# EAGLE design radio_V11.04.12 (EAGLE 5.01)
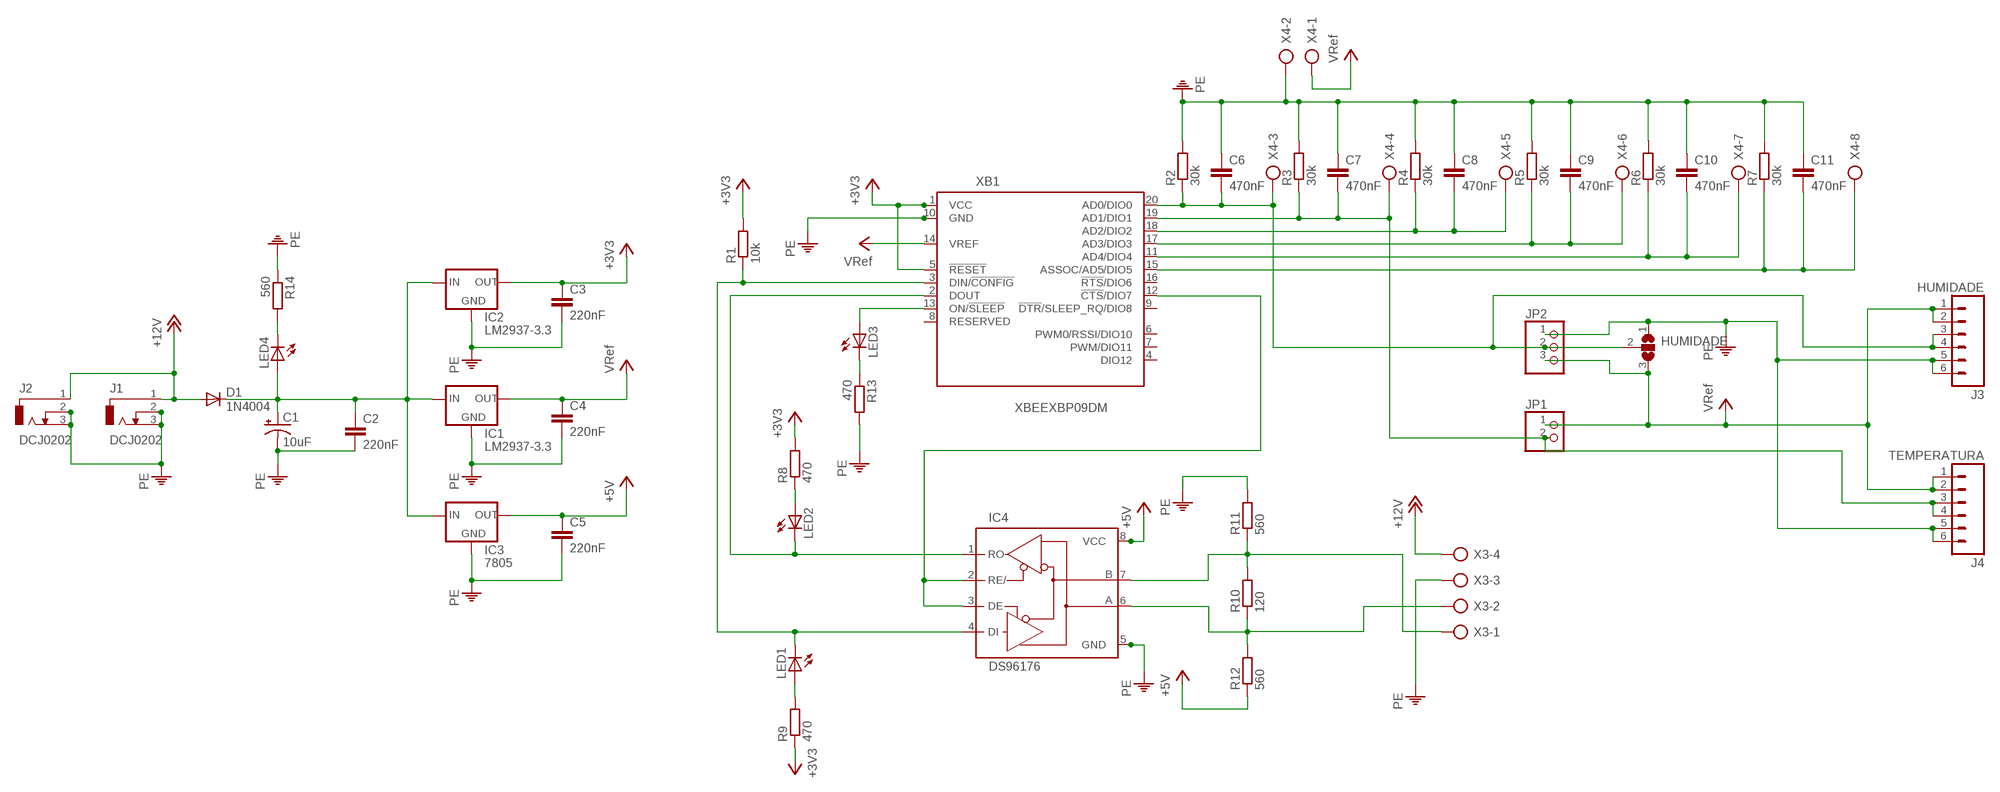
[diagram p0: schematic, sheet 1]

## Parts
C1  10uF  CPOL-USE2-5  [E2-5]
C2  220nF  C5/3.5  [C5B3.5]
C3  220nF  C5/3.5  [C5B3.5]
C4  220nF  C5/3.5  [C5B3.5]
C5  220nF  C5/3.5  [C5B3.5]
C6  470nF  C5/3.5  [C5B3.5]
C7  470nF  C5/3.5  [C5B3.5]
C8  470nF  C5/3.5  [C5B3.5]
C9  470nF  C5/3.5  [C5B3.5]
C10  470nF  C5/3.5  [C5B3.5]
C11  470nF  C5/3.5  [C5B3.5]
D1  1N4004  [DO41-10]
HUMIDADE  SJ2W  [SJ_2]
IC1  LM2937-3.3  78XXL  [78XXL]
IC2  LM2937-3.3  78XXL  [78XXL]
IC3  7805  78XXL  [78XXL]
IC4  DS96176  MAX3468CPA  [DIL08]
J1  DCJ0202  [DCJ0202]
J2  DCJ0202  [DCJ0202]
J3  HUMIDADE  RJ11-6PTH  [RJ11-6]
J4  TEMPERATURA  RJ11-6PTH  [RJ11-6]
JP1  PINHD-1X2  [1X02]
JP2  PINHD-1X3  [1X03]
LED1  LED3MM  [LED3MM]
LED2  LED3MM  [LED3MM]
LED3  LED3MM  [LED3MM]
LED4  LED5MM  [LED5MM]
R1  10k  R-EU_0207/7  [0207/7]
R2  30k  R-EU_0207/7  [0207/7]
R3  30k  R-EU_0207/7  [0207/7]
R4  30k  R-EU_0207/7  [0207/7]
R5  30k  R-EU_0207/7  [0207/7]
R6  30k  R-EU_0207/7  [0207/7]
R7  30k  R-EU_0207/7  [0207/7]
R8  470  R-EU_0207/7  [0207/7]
R9  470  R-EU_0207/7  [0207/7]
R10  120  R-EU_0207/7  [0207/7]
R11  560  R-EU_0207/7  [0207/7]
R12  560  R-EU_0207/7  [0207/7]
R13  470  R-EU_0207/7  [0207/7]
R14  560  R-EU_0207/7  [0207/7]
X3  AK500/4-H  [AK500/4-H]
X4  AK500/8-H  [AK500/8-H]
XB1  XBEEXBP09DM  [XBEE-PRO]

## Nets
+3V3: C3.1 IC2.OUT R1.2 R8.2 R9.1 XB1.1(VCC) XB1.5(!RESET)
+5V: C5.1 IC3.OUT IC4.8(VCC) R12.1
+12V: D1.A J1.1 J2.1 X3.4
CTS: IC4.2(RE/) IC4.3(DE) XB1.12(!CTS!/DIO7)
DIN: IC4.4(DI) LED1.K(C) R1.1 XB1.3(DIN/!CONFIG)
N$2: C1.+ C2.1 D1.C IC1.IN IC2.IN IC3.IN LED4.A
N$3: C6.2 HUMIDADE.2 J3.3 J3.4 JP2.2 R2.1 X4.3 XB1.20(AD0/DIO0)
N$4: C7.2 J4.3 J4.4 JP1.2 R3.1 X4.4 XB1.19(AD1/DIO1)
N$5: C8.2 R4.1 X4.5 XB1.18(AD2/DIO2)
N$6: C9.2 R5.1 X4.6 XB1.17(AD3/DIO3)
N$7: C10.2 R6.1 X4.7 XB1.11(AD4/DIO4)
N$8: C11.2 R7.1 X4.8 XB1.15(ASSOC/AD5/DIO5)
N$9: IC4.1(RO) LED2.K(C) XB1.2(DOUT)
N$10: LED2.A R8.1
N$11: LED1.A R9.2
N$13: LED3.A XB1.13(ON/!SLEEP)
N$14: LED3.K(C) R13.1
N$15: LED4.K(C) R14.2
N$16: IC4.6(A) R10.1 R12.2 X3.2
N$17: IC4.7(B) R10.2 R11.1 X3.1
PE: C1.- C2.2 C3.2 C4.2 C5.2 C6.1 C7.1 C8.1 C9.1 C10.1 C11.1 HUMIDADE.1 IC1.GND IC2.GND IC3.GND IC4.5(GND) J1.2 J1.3 J2.2 J2.3 J3.5 J3.6 J4.5 J4.6 JP2.1 R2.2 R3.2 R4.2 R5.2 R6.2 R7.2 R11.2 R13.2 R14.1 X3.3 X4.2 XB1.10(GND)
VCC: C4.1 HUMIDADE.3 IC1.OUT J3.1 J3.2 J4.1 J4.2 JP1.1 JP2.3 X4.1 XB1.14(VREF) ; supply symbol labelled VRef
Unconnected: XB1.6(PWM0/RSSI/DIO10) XB1.7(PWM/DIO11) XB1.9(!DTR!/SLEEP_RQ/DIO8) XB1.16(!RTS!/DIO6)

## Power pins joined to a net without a drawn wire
DIO12: XB1.4(DIO12)
RESERVED: XB1.8(RESERVED)

## Library data of the parts
C1 = rcl:CPOL-US: POLARIZED CAPACITOR, American symbol
C2-C11 = capacitor-wima:C: CAPACITOR naming: grid - package width
D1 = diode:1N4004: DIODE general purpose rectifier, 1 A
HUMIDADE = jumper:SJ2W: SMD solder JUMPER
IC1-IC3 = v-reg:78XXL: VOLTAGE REGULATOR
IC4 = maxim:MAX34*: +5V, Fail-Safe, 40Mbps, Profibus RS-485/RS-422 Transceivers Source: MAX3465-MAX3469.pdf
J1 J2 = con-jack:DCJ0202: DC POWER JACK Source: DCJ0202.pdf
J3 J4 = SparkFun:RJ11-6: RJ11 Jack Simple 6 pin RJ11 jack. Commonly found on CAT3 devices and Microchip programmers. SKU: PRT-00132
JP1 = pinhead:PINHD-1X2: PIN HEADER
JP2 = pinhead:PINHD-1X3: PIN HEADER
LED1-LED4 = led:LED: LED OSRAM: - CHIPLED LG R971, LG N971, LY N971, LG Q971, LY Q971, LO R971, LY R971 LH N974, LH R974 LS Q976, LO Q976, LY Q976 LO Q996 - Hyper CHIPLED LW Q18S LB Q993, LB Q99A, LB R99A - SideLED LS A670, LO A670, LY A670, LG A670, LP A670 LB A673, LV A673, LT A673, LW A673 LH A674 LY A675 LS A676, LA A676, LO A676, LY A676, LW A676 LS A679, LY A679, LG A679 - Hyper Micro SIDELED® LS Y876, LA Y876, LO Y876, LY Y876 LT Y87S - SmartLED LW L88C, LW L88S LB L89C, LB L89S, LG L890 LS L89K, LO L89K, LY L89K LS L896, LA L896, LO L896, LY L896 - TOPLED LS T670, LO T670, LY T670, LG T670, LP T670 LSG T670, LSP T670, LSY T670, LOP T670, LYG T670 LG T671, LOG T671, LSG T671 LB T673, LV T673, LT T673, LW T673 LH T674 LS T676, LA T676, LO T676, LY T676, LB T676, LH T676, LSB T676, LW T676 LB T67C, LV T67C, LT T67C, LS T67K, LO T67K, LY T67K, LW E67C LS E67B, LA E67B, LO E67B, LY E67B, LB E67C, LV E67C, LT E67C LW T67C LS T679, LY T679, LG T679 LS T770, LO T770, LY T770, LG T770, LP T770 LB T773, LV T773, LT T773, LW T773 LH T774 LS E675, LA E675, LY E675, LS T675 LS T776, LA T776, LO T776, LY T776, LB T776 LHGB T686 LT T68C, LB T68C - Hyper Mini TOPLED® LB M676 - Mini TOPLED Santana® LG M470 LS M47K, LO M47K, LY M47K Source: http://www.osram.convergy.de - LUMILED® LXK2-PW12-R00, LXK2-PW12-S00, LXK2-PW14-U00, LXK2-PW14-V00 LXK2-PM12-R00, LXK2-PM12-S00, LXK2-PM14-U00 LXK2-PE12-Q00, LXK2-PE12-R00, LXK2-PE12-S00, LXK2-PE14-T00, LXK2-PE14-U00 LXK2-PB12-K00, LXK2-PB12-L00, LXK2-PB12-M00, LXK2-PB14-N00, LXK2-PB14-P00, LXK2-PB14-Q00 LXK2-PR12-L00, LXK2-PR12-M00, LXK2-PR14-Q00, LXK2-PR14-R00 LXK2-PD12-Q00, LXK2-PD12-R00, LXK2-PD12-S00 LXK2-PH12-R00, LXK2-PH12-S00 LXK2-PL12-P00, LXK2-PL12-Q00, LXK2-PL12-R00 Source: www.luxeon.com
R1-R14 = resistor:R-EU_: RESISTOR, European symbol
X3 = con-ptr500:AK500/4-H: CONNECTOR Aug. 2004 / PTR Meßtechnik: Die Bezeichnung der Serie AK505 wurde geändert. Es handelt sich hierbei um AK500 in horizontaler Ausführung.
X4 = con-ptr500:AK500/8-H: CONNECTOR Aug. 2004 / PTR Meßtechnik: Die Bezeichnung der Serie AK505 wurde geändert. Es handelt sich hierbei um AK500 in horizontaler Ausführung.
XB1 = maxstream3:XBEE: XBee (TM) /XBee-PRO(TM) OEM RF Modules Source: MaxStream, Inc. xbee_productmanual.pdf

## Board
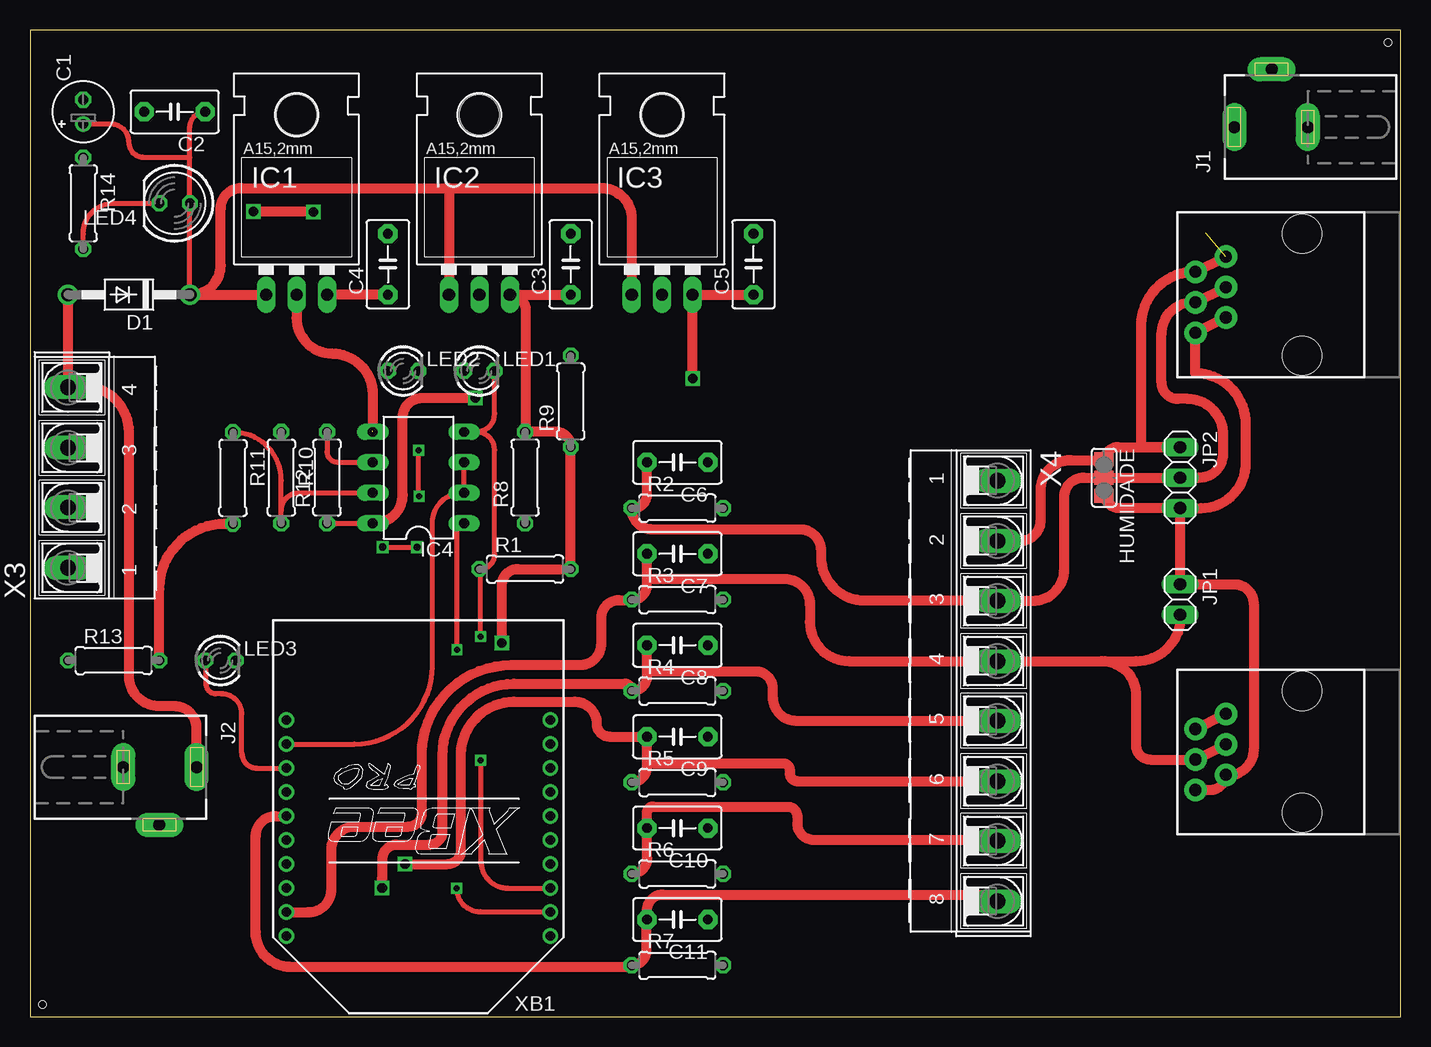
[diagram p1: board, top side]
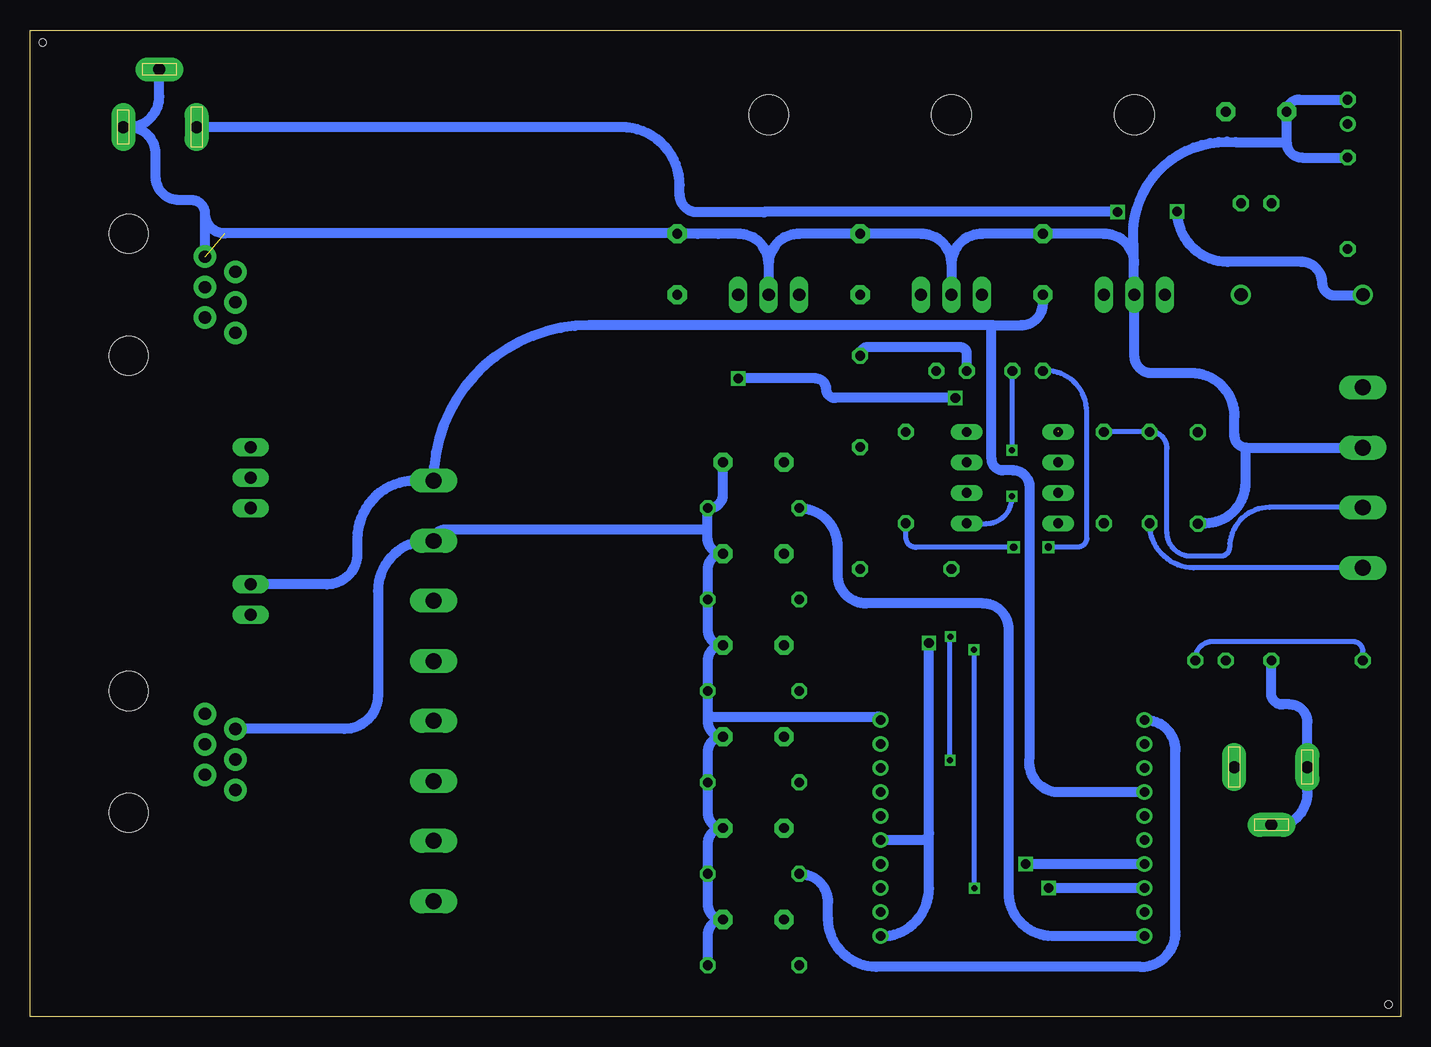
[diagram p2: board, bottom side, seen from below]

Size 114.28 x 82.22 mm. Coordinates in mm from the lower left corner, seen from the top.
Outline: 0,0 114.28,0 114.28,82.22 0,82.22 0,0
Copper layers (1*16): Top 0.035mm / dielectric 1.5mm / Bottom 0.035mm
Design rules "default": minimum track width 10mil, minimum drill 24mil, track to track 8mil, track to pad 8mil, pad to pad 8mil, via to via 8mil, smd to smd 8mil, copper to edge 40mil, drill to drill 8mil, minimum pad ring 10mil, minimum via ring 8mil, stop-mask expansion 4mil, vias tented up to drill 0mil, thermal gap 10mil
Holes 0.6 mm at 113.22,81.17 1.04,1.02

### Footprints (pad centres in the part's own frame; a part is rotated, then mirrored left to right if it is on the bottom)
E2-5 = drill 0.813 pad 1.27 round: + -1.016,0 | drill 0.813 pad 1.27 octagon: - 1.016,0
C5B3.5 = drill 0.813 pad 1.6 octagon: 1 -2.54,0; 2 2.54,0
DO41-10 = drill 1.118 round: A 5.08,0; C -5.08,0
SJ_2 = smd 1.168 x 1.6: 1 -1.524,0; 2 0,0; 3 1.524,0
78XXL = drill 1.016 long: GND 0,-3.81; IN -2.54,-3.81; OUT 2.54,-3.81 | hole 3.302: 0,11.176
DIL08 = drill 0.813 long: 1 -3.81,-3.81; 2 -1.27,-3.81; 3 1.27,-3.81; 4 3.81,-3.81; 5 3.81,3.81; 6 1.27,3.81; 7 -1.27,3.81; 8 -3.81,3.81
DCJ0202 = drill 1 pad 2 long: 1 0,3.1; 2 4.8,0; 3 0,-3
RJ11-6 = drill 1.016 pad 1.88 round: 1 1.905,8.89; 2 3.175,6.35; 3 4.445,8.89; 4 5.715,6.35; 5 6.985,8.89; 6 8.255,6.35 | hole 3.251: 0,0; 10.16,0
1X02 = drill 1.016 long: 1 -1.27,0; 2 1.27,0
1X03 = drill 1.016 long: 1 -2.54,0; 2 0,0; 3 2.54,0
LED3MM = drill 0.813 octagon: A -1.27,0; K 1.27,0
LED5MM = drill 0.813 octagon: A -1.27,0; K 1.27,0
0207/7 = drill 0.813 octagon: 1 -3.81,0; 2 3.81,0
AK500/4-H = drill 1.321 long: 1 -7.518,0; 2 -2.489,0; 3 2.489,0; 4 7.518,0
AK500/8-H = drill 1.321 long: 1 -17.526,0; 2 -12.497,0; 3 -7.518,0; 4 -2.489,0; 5 2.489,0; 6 7.518,0; 7 12.497,0; 8 17.526,0
XBEE-PRO = drill 0.8 pad 1.27 round: 1 -11,9; 2 -11,7; 3 -11,5; 4 -11,3; 5 -11,1; 6 -11,-1; 7 -11,-3; 8 -11,-5; 9 -11,-7; 10 -11,-9; 11 11,-9; 12 11,-7; 13 11,-5; 14 11,-3; 15 11,-1; 16 11,1; 17 11,3; 18 11,5; 19 11,7; 20 11,9

### Placement (x,y rotation side)
C1  4.44,75.4 90 top
C2  12.06,75.4 180 top
C3  45.08,62.7 90 top
C4  29.84,62.7 90 top
C5  60.32,62.7 90 top
C6  53.97,46.19 180 top
C7  53.97,38.57 180 top
C8  53.97,30.95 180 top
C9  53.97,23.33 180 top
C10  53.97,15.71 180 top
C11  53.97,8.09 180 top
D1  8.25,60.16 180 top
HUMIDADE  89.53,44.92 270 top
IC1  22.22,63.97 0 top
IC2  37.46,63.97 0 top
IC3  52.7,63.97 0 top
IC4  32.38,44.92 90 top
J1  103.5,74.13 90 top
J2  10.79,20.79 270 top
J3  106.04,55.08 90 top
J4  106.04,16.98 90 top
JP1  95.88,34.76 270 top
JP2  95.88,44.92 270 top
LED1  37.46,53.81 0 top
LED2  31.11,53.81 0 top
LED3  15.87,29.68 0 top
LED4  12.06,67.78 180 top
R1  41.27,37.3 0 top
R2  53.97,42.38 0 top
R3  53.97,34.76 0 top
R4  53.97,27.14 0 top
R5  53.97,19.52 0 top
R6  53.97,11.9 0 top
R7  53.97,4.28 0 top
R8  41.27,44.92 90 top
R9  45.08,51.27 90 top
R10  20.95,44.92 270 top
R11  16.92,44.89 270 top
R12  24.76,44.92 90 top
R13  6.98,29.68 0 top
R14  4.44,67.78 270 top
X3  3.17,44.92 90 top
X4  80.64,27.14 270 top
XB1  32.38,15.71 180 top

### Tracks (layer width: path | path; a pad name or v marks a point on that pad's centre or on a via)
+3V3  (via drill 0.8 pad 0.81)
  Top 0.406: R1.2 arc90 45.08,37.32 | 45.06,47.48 arc-90 R9.1
  Top 0.813: IC2.OUT C3.1 | IC2.OUT arc-90 IC2.OUT | R9.1 R9.1 arc90 45.11,47.48 arc90 43.85,48.73 R8.2 arc90 41.3,48.7 41.34,48.7 41.34,58.82 arc90 IC2.OUT | R1.2 arc90 R1.2 arc-90 R1.2 | R1.2 | R1.2 R9.1 | R1.2 40.66,37.3 arc90 39.34,35.98 v39.34,31.14
  Bottom 0.813: XB1.1 43.35,6.71 arc90 43.32,6.68 arc-90 39.34,10.66 39.34,15.32 | 39.34,15.32 v39.34,31.14 | 39.34,15.32 39.33,15.32 arc90 39.94,14.71 XB1.5
+5V  (via drill 0.8 pad 0.81)
  Top 0.406: 28.63,41.11 arc90 28.65,41.13 arc-90 28.63,41.11 | R12.1 IC4.8 28.63,41.11
  Top 0.813: C5.1 IC3.OUT 55.24,53.19 arc90 v55.25,53.18 | v37.14,51.57 32.69,51.56 arc90 31.07,49.93 31.07,43.48 arc-90 28.71,41.12 arc-90 28.7,41.11 IC4.8
  Bottom 0.813: v55.25,53.18 48.8,53.18 arc90 47.91,52.29 arc-90 47.17,51.56 v37.14,51.57
+12V  (via drill 0.8)
  Top 0.813: J2.1 13.89,24.04 arc90 12.06,25.87 10.79,25.87 arc-90 8.25,28.41 8.25,48.73 arc90 4.44,52.54 3.17,52.54 X3.4 D1.A | v23.62,67.06 arc90 23.58,67.1 v18.64,67.1
  Bottom 0.813: 53.08,67.06 arc-90 53.12,67.02 | v23.62,67.06 53.08,67.06 | v18.64,67.1 arc-90 14.43,62.9 8.31,62.9 arc90 6.55,61.14 arc-90 5.49,60.08 3.12,60.08 3.12,60.11 arc-90 D1.A | J1.1 64.96,74.13 arc90 60.12,69.29 60.12,68.5 arc-90 58.66,67.04 53.07,67.04 arc90 53.06,67.03 arc90 53.08,67.05 53.08,67.06
CTS
  Top 0.406: XB1.12 27.06,22.71 arc90 33.54,29.2 33.54,41.16 arc-90 36.03,43.64 arc-90 36.04,43.65 IC4.2 36.19,46.18 arc90 36.17,46.2 arc90 36.18,46.19 IC4.3
DIN  (via drill 0.5 pad 0.81)
  Top 0.406: 37.21,48.73 IC4.4 | 37.21,48.73 arc90 38.73,50.25 38.73,53.7 arc90 38.71,53.72 arc90 38.73,53.74 LED1.K | 37.21,48.73 | 37.21,48.73 IC4.4 | 37.21,48.73 arc-90 38.73,47.2 38.73,38.51 arc-90 37.5,37.28 arc90 37.48,37.3 R1.1 R1.1 arc-90 37.51,37.26 arc-90 37.56,37.2 v37.56,31.67 | XB1.3 39.82,10.71 arc-90 37.59,12.95 37.59,21.35 arc90 v37.58,21.36
  Bottom 0.406: v37.58,21.36 37.58,31.66 arc90 v37.56,31.67
N$2
  Top 0.406: D1.C LED4.A 13.33,71.59 | 13.33,71.59 13.33,74.13 arc-90 C2.1 | C1.+ 6.73,74.38 arc-90 8.25,72.86 arc90 9.52,71.59 13.33,71.59
  Top 0.813: IC1.IN D1.C 13.45,60.16 arc-90 13.46,60.16 arc90 15.91,62.61 15.91,67.35 arc-90 17.61,69.05 34.92,69.05 | 34.92,69.05 47.62,69.05 arc-90 50.16,66.51 IC3.IN | 34.92,69.05 IC2.IN
N$3
  Top 0.813: C6.2 51.43,43.53 arc-90 50.26,42.36 arc90 50.23,42.38 R2.1 50.16,42.35 arc-90 50.14,42.33 arc90 51.86,40.61 64.18,40.61 arc-90 65.94,38.85 65.94,38.3 arc90 69.56,34.68 80.58,34.68 | 80.58,34.68 arc90 80.6,34.66 X4.3 | 80.58,34.68 arc90 80.61,34.65 83.61,34.65 arc90 86.21,37.25 86.21,43.29 arc-90 87.84,44.92 HUMIDADE.2 JP2.2 97.47,44.92 arc90 99.47,46.91 99.47,48.5 arc90 96.49,51.48 95.68,51.48 arc-90 94.33,52.83 94.33,56.88 arc-90 97,59.55 arc90 97.02,59.52 J3.3 99.59,60.73 J3.4
  Bottom 0.813: XB1.20 29.05,6.71 arc90 32.68,10.34 32.68,32.27 arc-90 34.85,34.44 44.58,34.44 arc90 46.94,36.79 46.94,39.16 arc-90 50.14,42.35 arc90 R2.1
N$4
  Top 0.813: 50.17,34.71 arc-90 50.16,34.71 R3.1 | 51.43,36.52 51.43,35.97 arc-90 50.17,34.71 | 51.43,36.52 C7.2 | 51.43,36.52 51.5,36.52 arc90 51.54,36.48 62.89,36.48 arc-90 65.02,34.36 65.02,32.89 arc90 68.27,29.63 X4.4 89.35,29.63 | JP1.2 95.88,33.45 arc90 95.95,33.37 arc-90 92.21,29.63 89.35,29.63 | J4.4 99.55,22.63 J4.3 93.39,21.42 arc-90 92.21,22.61 92.21,26.78 arc90 89.35,29.63 | 50.17,34.71 49.08,34.71 arc90 47.63,33.26 47.63,31.08 arc-90 45.85,29.3 40.13,29.3 arc90 32.67,21.84 32.67,16.96 arc-90 31.55,15.84 27.08,15.84 arc90 25.13,13.9 25.13,10.61 arc-90 23.22,8.7 21.64,8.7 arc90 21.63,8.71 XB1.19
N$5  (via drill 0.8 pad 0.81)
  Top 0.813: 51.43,28.72 51.43,28.32 arc-90 50.27,27.17 arc-90 50.25,27.14 R4.1 50.16,27.2 arc90 50.14,27.22 arc90 49.62,27.74 40.34,27.74 arc90 34.39,21.79 34.39,15.44 arc-90 33.28,14.33 30.55,14.33 arc90 29.39,13.16 29.39,11.54 arc-90 29.38,11.53 arc90 29.35,11.5 v29.35,10.71 | 51.43,28.72 C8.2 | X4.5 63.89,24.65 arc-90 61.91,26.63 61.91,27.36 arc90 60.49,28.78 51.56,28.78 arc90 51.51,28.72 51.43,28.72
  Bottom 0.813: XB1.18 v29.35,10.71 arc90 v29.35,10.71
N$6  (via drill 0.8 pad 0.81)
  Top 0.813: C9.2 arc90 51.4,23.3 51.4,21.14 | R5.1 arc90 51.4,20.76 51.4,21.14 | X4.6 63.97,19.62 arc-90 63.35,20.24 63.35,20.53 arc90 62.77,21.11 51.45,21.11 arc-90 51.41,21.14 51.4,21.14 | v31.27,12.72 34.81,12.72 arc90 35.93,13.84 35.93,21.83 arc-90 40.34,26.24 45.4,26.24 arc-90 47.24,24.4 arc90 48.32,23.33 C9.2 | C9.2 arc-90 C9.2
  Bottom 0.813: XB1.17 v31.26,12.71 arc90 v31.27,12.72
N$7
  Top 0.813: R6.1 arc90 51.45,13.19 51.45,15.69 arc90 C10.2 51.43,16.99 arc-90 51.94,17.5 arc90 51.96,17.49 63.17,17.49 arc-90 63.97,16.7 63.97,16.09 arc90 65.32,14.73 80.76,14.73 arc-90 80.8,14.7 arc-90 80.74,14.64 X4.7
  Bottom 0.813: XB1.11 21.31,24.71 arc90 18.78,22.19 18.78,7.04 arc90 21.68,4.14 43.72,4.14 arc90 47.75,8.17 47.75,9.55 arc-90 50.06,11.87 arc-90 50.1,11.9 R6.1
N$8
  Top 0.813: X4.8 80.64,9.65 arc90 80.62,9.67 arc90 80.11,10.17 52.76,10.17 arc90 51.43,8.85 C11.2 arc90 51.38,8.04 51.38,5.5 arc-90 R7.1 R7.1 arc-90 50.25,4.2 arc-90 50.19,4.14 21.71,4.14 arc-90 18.82,7.04 18.82,15.05 arc-90 20.47,16.71 XB1.15
N$9  (via drill 0.5 pad 0.81)
  Top 0.406: v32.41,47.21 32.41,43.37 arc90 v32.43,43.35 | IC4.1 arc90 35.6,40.52 35.6,37.2 arc90 35.58,37.18 v35.58,30.57 | XB1.2 arc90 43.35,8.74 37.53,8.74 arc-90 v35.56,10.71
  Bottom 0.406: LED2.K 32.38,47.24 arc90 v32.41,47.21 | v32.43,43.35 32.43,43.22 arc90 34.56,41.09 36.22,41.09 arc90 IC4.1 | v35.58,30.57 arc90 35.56,30.55 v35.56,10.71
N$10  (via drill 0.6)
  Top 0.406: v32.28,39.1 29.42,39.1 arc-90 v29.39,39.13
  Bottom 0.406: R8.1 41.27,39.95 arc-90 40.42,39.1 v32.28,39.1 | v29.39,39.13 26.95,39.13 arc-90 26.18,39.9 26.18,50.42 arc-90 29.59,53.83 arc90 29.6,53.81 LED2.A
N$11
  Bottom 0.813: LED1.A 36.19,55.25 arc-90 36.73,55.79 44.44,55.79 arc-90 45.12,55.11 arc-90 45.09,55.08 R9.2
N$13
  Top 0.406: XB1.13 18.91,20.71 arc-90 17.66,21.95 17.66,25.2 arc90 15.96,26.9 15.5,26.9 arc-90 14.69,27.71 14.69,29.45 arc90 14.54,29.61 arc90 LED3.A
N$14
  Bottom 0.406: R13.1 3.17,30.46 arc-90 3.96,31.25 15.69,31.25 arc-90 17.17,29.78 arc90 17.14,29.75 LED3.K
N$15
  Top 0.406: R14.2 4.44,65.24 arc-90 6.98,67.78 LED4.K
N$16
  Top 0.406: R12.2 24.76,47.08 arc90 25.64,46.21 28.45,46.21 arc-90 28.52,46.14 arc90 IC4.6
  Bottom 0.406: R12.2 R10.1 arc90 20.93,48.75 20.88,48.75 arc90 19.49,47.36 19.49,40.35 arc-90 17.5,38.37 15.03,38.37 arc-90 14.28,39.12 arc90 10.96,42.43 X3.2
N$17
  Top 0.406: IC4.7 IC4.7 arc90 IC4.7 22.42,43.64 arc90 20.95,42.18 R10.2 arc90 R10.2 | R10.2 20.95,41.05 | R11.1 arc-90 20.95,44.67 R10.2
  Bottom 0.406: R10.2 20.95,41.07 arc-90 20.93,41.05 arc-90 17.28,37.4 X3.1
N$18
  Bottom 0.813: 99.64,63.39 arc90 99.69,63.44 99.69,67.05
PE  (2 unrouted)
  Top 0.813: X4.2 82.53,39.64 arc90 84.25,41.36 84.25,43.88 arc-90 86.75,46.38 89.56,46.38 arc90 89.64,46.46 arc-90 89.63,46.44 HUMIDADE.1 89.61,46.44 arc-90 89.62,46.43 arc-90 90.65,47.46 JP2.1 92.63,47.46 92.63,57.58 arc-90 97.15,62.1 arc90 97.15,62.1 J3.5 99.62,63.28 J3.6 | J4.6 99.61,25.2 J4.5 | R13.2 10.79,35.63 arc-90 16.24,41.08 R11.2 arc90 R11.2 | IC4.5 28.57,51.87 arc90 25.19,55.26 arc-90 22.23,58.22 IC1.GND IC1.GND arc-90 IC1.GND
  Bottom 0.406: IC1.GND 22.22,62.7
  Bottom 0.813: R14.1 8.25,71.59 arc90 9.52,72.86 | 9.52,72.86 C2.2 arc90 8.5,76.42 C1.- | 22.22,62.7 arc-90 24.76,65.24 C4.2 34.92,65.24 arc-90 37.46,62.7 | 37.46,62.7 IC2.GND | 37.46,62.7 arc-90 40,65.24 C3.2 50.16,65.24 arc-90 52.7,62.7 | 52.7,62.7 IC3.GND | 52.7,62.7 arc-90 55.24,65.24 arc0 60.29,65.22 C5.2 arc90 60.29,65.27 | 9.52,72.86 13.76,72.87 arc-90 22.28,65.92 IC1.GND 22.22,55.08 arc-90 20.77,53.62 17.45,53.62 arc90 13.85,50.02 13.88,50.02 | 106.04,74.13 J1.3 | J1.2 103.5,76.67 arc90 106.04,74.13 | J2.2 10.79,15.71 arc-90 7.79,18.71 J2.3 7.79,24.54 arc-90 9.27,26.01 9.88,26.01 arc90 10.82,26.95 10.82,29.55 arc90 10.79,29.58 arc-90 10.79,29.59 R13.2 10.79,29.4 | C9.1 arc-90 57.78,22.06 R5.2 57.78,16.98 arc-90 C10.1 | C10.1 arc-90 57.78,14.44 R6.2 57.78,9.36 arc-90 C11.1 arc-90 57.78,6.82 R7.2 | C9.1 arc90 57.78,24.6 57.78,25.21 | 57.78,25.21 R4.2 57.78,29.68 arc90 C8.1 arc90 57.78,32.22 R3.2 57.78,37.3 arc90 C7.1 arc90 57.8,39.86 57.8,40.59 | 57.8,40.59 57.8,42.38 R2.2 arc-90 R2.2 57.65,42.38 arc-90 57.64,42.38 arc-90 56.51,43.52 C6.1 | J4.5 97.21,23.96 arc90 97.23,23.98 88.05,23.98 arc-90 85.27,26.77 85.27,35.48 arc90 81.12,39.64 X4.2 arc90 79.69,40.59 57.8,40.59 | 106.04,74.13 arc90 103.81,71.9 103.81,69.99 arc-90 101.86,68.05 100.8,68.05 arc90 99.69,66.93 arc-90 98.03,65.27 60.29,65.27 | J3.6 arc90 J3.6 | 56.59,15.69 arc90 56.57,15.71 C10.1 | 60.29,65.27 60.24,65.27 | C9.1 56.51,23.52 | XB1.10 43.33,24.71 arc-90 43.31,24.72 arc-90 43.6,25.01 57.5,25.01 arc90 57.71,25.21 57.78,25.21 | X3.3 arc90 3.19,47.39 10.06,47.39 arc-90 10.06,47.39 12.81,47.39
  Bottom 0.813: R11.2 16.34,41.11 arc-90 16.32,41.12 arc-90 12.94,44.51 12.94,47.3 12.9,47.3 arc-90 12.81,47.39 | 28.56,48.83 arc-90 28.57,48.83 | 13.87,50.11 arc-90 13.88,50.1 13.88,50.02 | 13.88,50.02 13.88,48.46 arc-90 12.81,47.39
VCC
  Top 0.813: C4.1 IC1.OUT | JP2.3 90.8,42.38 arc-90 89.53,43.65 HUMIDADE.3 | JP2.3 JP1.1 100.39,36.03 arc-90 102,34.42 102,22.27 arc-90 99.82,20.09 arc90 99.76,20.15 J4.2 J4.2 arc90 99.68,20.17 arc-90 98.4,18.88 J4.1 | J3.2 99.65,58.27 J3.1 97.15,56.88 arc-90 97.14,56.87 97.14,53.62 arc-90 101.35,49.4 101.35,46.11 arc-90 97.63,42.38 JP2.3
  Bottom 0.813: JP1.1 89.53,36.03 arc-90 86.99,38.57 86.99,39.84 arc90 82.16,44.67 X4.1 80.64,44.63 arc90 80.66,44.61 arc90 67.65,57.62 34.62,57.62 | C4.1 29.84,59.42 arc90 31.64,57.62 34.02,57.62 | 34.02,57.62 34.62,57.62 | XB1.14 28.85,18.71 arc90 30.94,21.61 30.94,44.13 arc-90 32.34,45.52 33.19,45.52 arc90 34.12,46.45 34.12,57.49 arc90 34.02,57.58 34.02,57.62 | 34.62,57.62 34.62,57.65 arc90 34.58,57.62